# EAGLE design ASM2101 (EAGLE 6.3)
DATABASE: ./../../../../../Components/TinyCircuits_Part_Database.txt
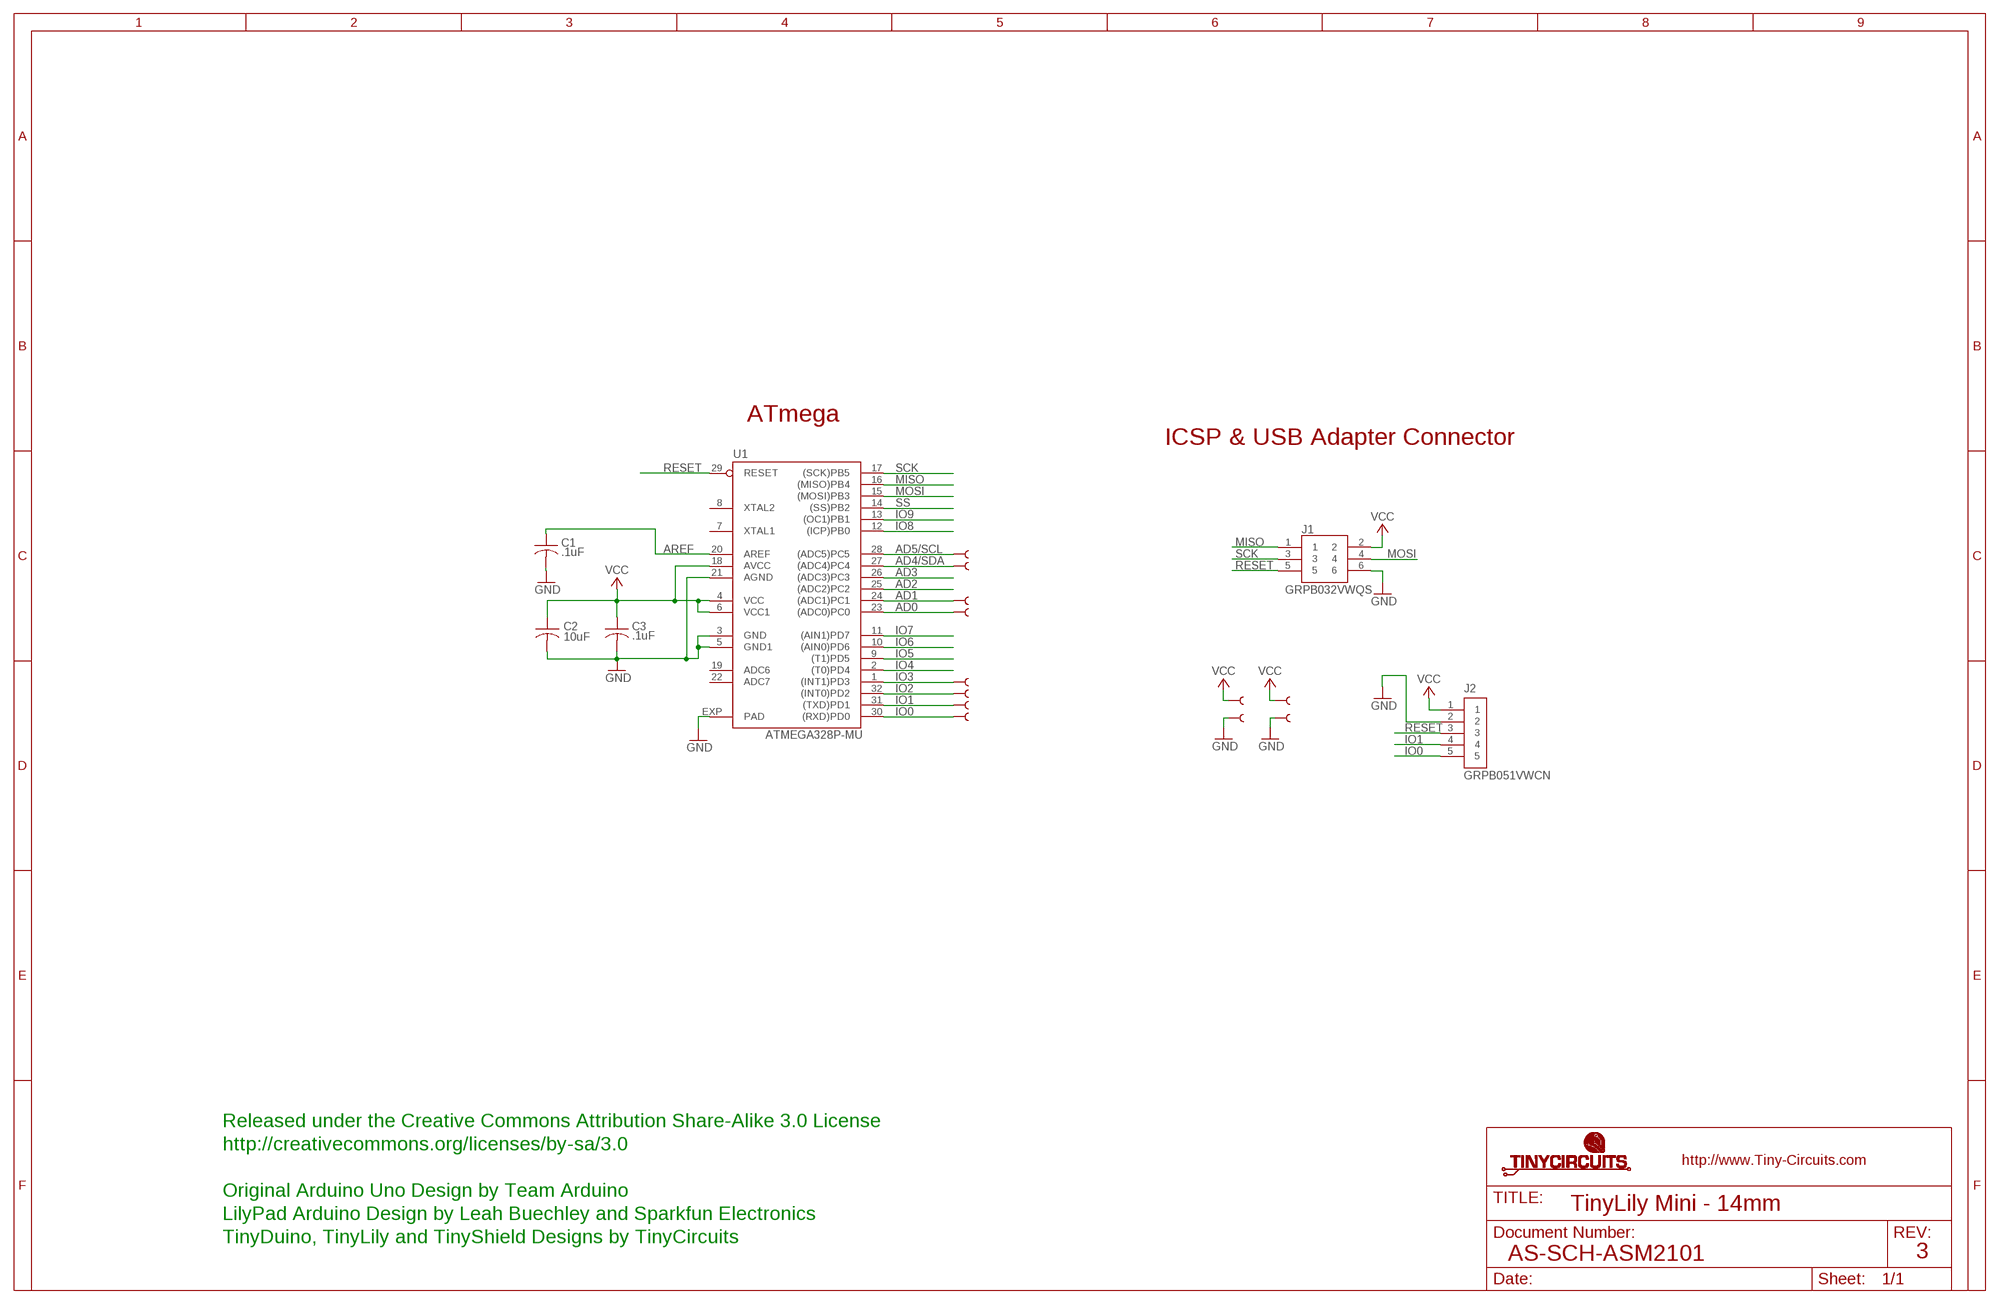
[diagram p0: schematic, sheet 1]

## Parts
$1  SEWTAB  [SEWTAP_TH]
C1  .1uF  AS-ITM-00008  [C0402]
C2  10uF  AS-ITM-00002  [C0603]
C3  .1uF  AS-ITM-00008  [C0402]
J1  GRPB032VWQS  AS-ITM-00034  [2X3_.05"_SMT_HEADER]
J2  GRPB051VWCN  AS-ITM-00036  [1X5_.05_RA_TH_HEADER]
U1  ATMEGA328P-MU  AS-ITM-00013MU  [ATMEL_QFN32]
U$1  SEWTAB  [SEWTAP_TH]
U$2  SEWTAB  [SEWTAP_TH]
U$3  SEWTAB  [SEWTAP_TH]
U$4  SEWTAB  [SEWTAP_TH]
U$5  SEWTAB  [SEWTAP_TH]
U$7  SEWTAB  [SEWTAP_TH]
U$8  SEWTAB  [SEWTAP_TH]
U$9  SEWTAB  [SEWTAP_TH]
U$10  SEWTAB  [SEWTAP_TH]
U$11  SEWTAB  [SEWTAP_TH]
U$12  SEWTAB  [SEWTAP_TH]

## Nets
AD0: U1.23((ADC0)PC0) U$4.1
AD1: U1.24((ADC1)PC1) U$3.1
AD2: U1.25((ADC2)PC2)
AD3: U1.26((ADC3)PC3)
AD4/SDA: U1.27((ADC4)PC4) U$2.1
AD5/SCL: U1.28((ADC5)PC5) U$1.1
AREF: C1.1 U1.20(AREF)
GND: C1.2 C2.2 C3.2 J1.6 J2.2 U1.3(GND) U1.5(GND1) U1.21(AGND) U1.EXP(PAD) U$11.1 U$12.1
IO0: J2.5 U1.30((RXD)PD0) U$10.1
IO1: J2.4 U1.31((TXD)PD1) U$9.1
IO2: $1.1 U1.32((INT0)PD2)
IO3: U1.1((INT1)PD3) U$5.1
IO4: U1.2((T0)PD4)
IO5: U1.9((T1)PD5)
IO6: U1.10((AIN0)PD6)
IO7: U1.11((AIN1)PD7)
IO8: U1.12((ICP)PB0)
IO9: U1.13((OC1)PB1)
MISO: J1.1 U1.16((MISO)PB4)
MOSI: J1.4 U1.15((MOSI)PB3)
RESET: J1.5 J2.3 U1.29(RESET)
SCK: J1.3 U1.17((SCK)PB5)
SS: U1.14((SS)PB2)
VCC: C2.1 C3.1 J1.2 J2.1 U1.4(VCC) U1.6(VCC1) U1.18(AVCC) U$7.1 U$8.1
Unconnected: U1.7(XTAL1) U1.8(XTAL2) U1.19(ADC6) U1.22(ADC7)

## Notes on the sheet
- ATmega
- ICSP & USB Adapter Connector
- Released under the Creative Commons Attribution Share-Alike 3.0 License
- http://creativecommons.org/licenses/by-sa/3.0
- Original Arduino Uno Design by Team Arduino
- TinyLily Mini - 14mm
- LilyPad Arduino Design by Leah Buechley and Sparkfun Electronics
- TinyDuino, TinyLily and TinyShield Designs by TinyCircuits
- AS-SCH-ASM2101 | 3

## Library data of the parts
$1 U$1-U$5 U$7-U$12 = tinycircuits:SEWTAB: TinyLily Sew Tab; BOM: EXCLUDE; DNP: T
C1 C3 = tinycircuits:AS-ITM-00008: CAP CER 0.1UF 10V 10% X5R 0402; PARTNO: AS-ITM-00008; VALUE: 0.1uF
C2 = tinycircuits:AS-ITM-00002: CAP CER 10UF 10V 20% X5R 0603; PARTNO: AS-ITM-00002
J1 = tinycircuits:AS-ITM-00034: CONN HEADER .050" SMD 6POS; DNP: T; PARTNO: AS-ITM-00034
J2 = tinycircuits:AS-ITM-00036: CONN HEADER .050" 5POS TH RA; PARTNO: AS-ITM-00036
U1 = tinycircuits:AS-ITM-00013: MCU AVR 32K FLASH 32-QFN; PARTNO: AS-ITM-00013

## Board
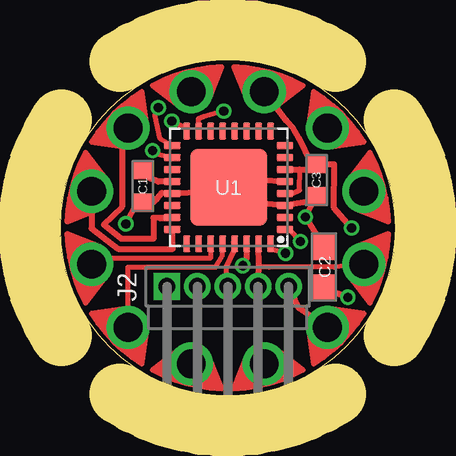
[diagram p1: board, top side]
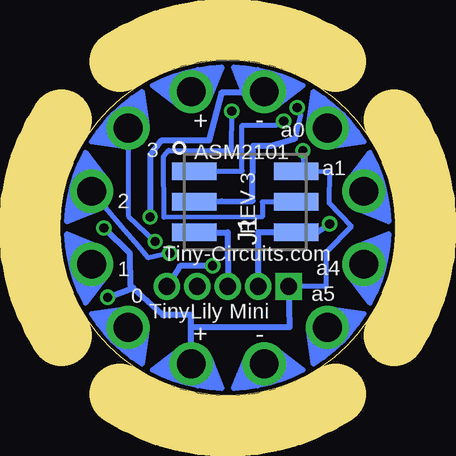
[diagram p2: board, bottom side, seen from below]

Size 14 x 14 mm. Coordinates in mm from the lower left corner, seen from the top.
Outline: 14,7 arc180 0,7 arc180 14,7
Copper layers (1*16): Top 0.035mm / dielectric 1.5mm / Bottom 0.035mm
Design rules "default": minimum track width 8mil, minimum drill 15mil, track to track 6mil, track to pad 6mil, pad to pad 6mil, via to via 6mil, smd to smd 6mil, copper to edge 6mil, drill to drill 8mil, minimum pad ring 8mil, minimum via ring 5mil, stop-mask expansion 4mil, vias tented up to drill 25mil, thermal gap 10mil
Milling: 4 lines

### Footprints (pad centres in the part's own frame; a part is rotated, then mirrored left to right if it is on the bottom)
SEWTAP_TH = drill 1.2 pad 1.803: 1 -0.127,0
C0402 = smd 0.7 x 0.9: 1 -0.65,0; 2 0.65,0
C0603 = smd 1.1 x 1: 1 -0.85,0; 2 0.85,0
2X3_.05"_SMT_HEADER = smd 1.854 x 0.737: 1 -2.125,1.27; 2 2.125,1.27; 3 -2.125,0; 4 2.125,0; 5 -2.125,-1.27; 6 2.125,-1.27
1X5_.05_RA_TH_HEADER = drill 0.7 pad 1.016 square: 1 -0.635,2.54 | drill 0.7 pad 1.016: 2 -0.635,1.27; 3 -0.635,0; 4 -0.635,-1.27; 5 -0.635,-2.54
ATMEL_QFN32 = smd 0.711 x 0.305: 1 -2.351,1.75; 2 -2.351,1.25; 3 -2.351,0.75; 4 -2.351,0.25; 5 -2.351,-0.25; 6 -2.351,-0.75; 7 -2.351,-1.25; 8 -2.351,-1.75; 17 2.351,-1.75; 18 2.351,-1.25; 19 2.351,-0.75; 20 2.351,-0.25; 21 2.351,0.25; 22 2.351,0.75; 23 2.351,1.25; 24 2.351,1.75 | smd 0.305 x 0.711: 9 -1.75,-2.351; 10 -1.25,-2.351; 11 -0.75,-2.351; 12 -0.25,-2.351; 13 0.25,-2.351; 14 0.75,-2.351; 15 1.25,-2.351; 16 1.75,-2.351; 25 1.75,2.351; 26 1.25,2.351; 27 0.75,2.351; 28 0.25,2.351; 29 -0.25,2.351; 30 -0.75,2.351; 31 -1.25,2.351; 32 -1.75,2.351 | smd 3.2 x 3.2: EXP 0,0

### Placement (x,y rotation side)
$1  12.55,8.49 345 bottom
C1  3.45,8.74 270 top
C2  11.01,5.36 90 top
C3  10.7,8.99 270 top
J1  6.27,8.08 0 bottom
J2  7,5.19 90 top
U1  7.03,8.68 180 top
U$1  2.93,2.93 135 bottom
U$2  1.45,5.51 165 bottom
U$3  1.45,8.49 195 bottom
U$4  2.93,11.07 225 bottom
U$5  11.07,11.07 315 bottom
U$6  [DOCFIELD-TINYCIRCUITS-PCB]  44,0 0 top  (outside the outline)
U$7  8.49,1.45 75 bottom
U$8  8.49,12.55 285 bottom
U$9  12.55,5.51 15 bottom
U$10  11.07,2.93 45 bottom
U$11  5.51,1.45 105 bottom
U$12  5.51,12.55 255 bottom

### Tracks (layer width: path | path; a pad name or v marks a point on that pad's centre or on a via)
AD0
  Top 0.254: U$4.1 2.6,10.33 2.59,7.88 1.83,7.13 2.57,6.53 3.9,6.54 3.9,7.42 4.58,7.42 4.57,7.41 4.17,7.39 4.39,7.42 U1.23
AD1
  Top 0.254: U$3.1 1.32,6.97 2.44,6.12 4.7,6.12 4.69,6.93 U1.24
AD4/SDA
  Top 0.203: 6.27,6.3 6.27,5.72 1.57,5.72
  Top 0.254: U1.27 6.27,6.3 | 1.57,5.72 U$2.1
AD5/SCL
  Top 0.203: U$1.1 2.84,5.36 6.5,5.36 6.78,5.84 U1.28
AREF
  Top 0.254: U1.20 4.11,8.92 3.75,9.06 C1.1
GND  (via drill 0.38)
  Top 0.203: U1.EXP 6.35,8.54
  Top 0.254: U1.5 7.34,9.02 | 7.34,9.02 U1.EXP 8.15,8.04 U1.3 10.66,8.14 C3.2 v10.24,7.45 C2.2 | 6.35,8.54 U1.21 4.24,8.45 4.04,8.21 4.03,8.2 | 7.34,9.02 7.17,9.02 | C1.2 3.51,8.2 4.03,8.2 | 4.03,8.2 3.89,8.06 3.23,8.06 3.2,8.03 v2.75,7.16 | U$11.1 5.69,2.35 J2.2
  Bottom 0.254: v2.75,7.16 3.27,6.81 J1.6 5.73,6.81 J2.2 | U$12.1 5.52,12.63 7.27,12.63 7.77,10.65 9.75,10.65 10.24,10.04 v10.24,7.45
IO0  (via drill 0.38)
  Top 0.254: U1.30 7.79,5.73 v7.63,5.42 | U$10.1 9.96,3.66 J2.5
  Bottom 0.254: v7.63,5.42 8.99,5.41 J2.5
IO1
  Top 0.203: U$9.1 11.43,5.36 8.74,5.36 8.29,5.36
  Top 0.254: J2.4 8.29,5.36 U1.31
IO2  (via drill 0.38)
  Top 0.203: 8.76,6.13 v9.41,5.94
  Top 0.254: U1.32 8.76,6.13
  Bottom 0.203: v9.41,5.94 10.31,5.75 10.85,6.38 11.3,6.91 $1.1
IO3  (via drill 0.38)
  Top 0.203: v10.03,6.43 9.58,6.94
  Top 0.254: 9.58,6.94 U1.1
  Bottom 0.203: U$5.1 11.15,8.26 11.15,7.5 v10.03,6.43
MISO  (via drill 0.38)
  Top 0.203: v4.67,11.45 5.28,11.15
  Top 0.254: 5.28,11.15 U1.16
  Bottom 0.203: 8.63,9.36 6.41,9.37 6.41,11.27 4.98,11.27 v4.67,11.45
  Bottom 0.254: J1.1 8.63,9.36
MOSI  (via drill 0.38)
  Top 0.203: v6.83,11.87 6.02,11.64 5.77,11.54 U1.15
  Bottom 0.203: J1.4 5.56,8.08 5.56,7.45 9.66,7.44 9.68,9.97 9.46,10.23 6.84,10.23 v6.83,11.87
RESET
  Top 0.203: 6.96,4.77 6.95,5.37 7.26,6.02 U1.29
  Top 0.254: U1.29 7.27,6.44 7.26,6.14 | J2.3 6.96,4.77
  Bottom 0.254: J1.5 7.01,6.81 J2.3
SCK  (via drill 0.38)
  Top 0.203: U1.17 4.18,10.71 3.96,11.68 v4.1,12.01
  Bottom 0.203: v4.1,12.01 3.97,11.69 4.19,10.72
  Bottom 0.254: J1.3 8.15,8.08 7.25,8.1 5.96,8.12 5.94,10.42 5.89,10.42 5.18,10.42 4.19,10.72
VCC  (via drill 0.38)
  Top 0.203: U1.4 9.68,8.43 9.99,8.56 10,9.43 | v3.86,10.22 3.81,10.09 4.02,10.08 U1.18
  Top 0.254: U$8.1 9.46,11.45 9.73,11.14 9.97,10.74 10.48,9.65 10.5,9.44 U1.6 10,9.43 10.45,9.42 C3.1 11.44,9.64 11.43,7.83 v12.17,6.99 | 8.38,1.56 8.49,1.45 U$7.1 | C2.1 v12.01,4.1
  Bottom 0.203: J2.1 2.9,4.55 2.9,5.97 1.85,7.06 2.77,8.02 2.77,9.37 J1.2 3.81,9.43 v3.86,10.22
  Bottom 0.254: v12.01,4.1 10.94,4.49 | 10.94,4.49 11.05,4.55 11.07,5.92 v12.17,6.99 | 8.49,1.45 U$7.1 8.53,2.85 | 8.53,2.85 8.53,3.36 9.7,3.36 10.94,4.49 | J2.1 4.42,2.85 8.53,2.85

### Text on the board
bPlace: a0 | - | + | ASM2101 | 3 | a1 | 2 | REV 3 | Tiny-Circuits.com | a4 | 1 | a5 | 0 | TinyLily Mini | - | +
Document: FABRICATION DRAWING | NOTES: | 1. PRINTED CIRCUIT BOARD MADE FROM NEMA GRADE FR-4 EPOXY LAMINATE | WITH 1 OUNCE COPPER PLATING AND .024 THICKNESS. | 2. ALL DIMENSIONS ARE GIVEN IN INCHES. | 3. CIRCUIT PATHS ARE FOR REFERENCE ONLY. | 4. HOLE SIZES SHOWN ARE FINISHED DIAMETERS AFTER PLATING. | 5. BOARD PLATED USING REFLOW OR SIMILAR METHOD. | 6. BOARD TO HAVE BLUE SOLDER MASK ON PLATED SURFACES USING WET FILM | 7. SILKSCREEN BOARD USING WHITE INK. | SR100 OR SR1010 EPOXY. EQUIVALENT WET OR DRY FILM MAY BE USED. | 8. THE FOLLOWING INFORMATION APPLIES TO THIS BOARD: | * 2 COPPER LAYERS | * .024 BOARD THICKNESS | * REQUIRES TOP SIDE SILKSCREEN | Released under the Creative Commons Attribution Share-Alike 3.0 License | http://creativecommons.org/licenses/by-sa/3.0 | LilyPad Arduino Design by Leah Buechley and Sparkfun Electronics | Original Arduino Uno Design by Team Arduino | TinyDuino, TinyLily and TinyShield Designs by TinyCircuits | TinyLily Mini - 14mm | AS-PCB-ASM2101 | 3